# EAGLE design MPU-6050_Breakout V11 (EAGLE 6.4)
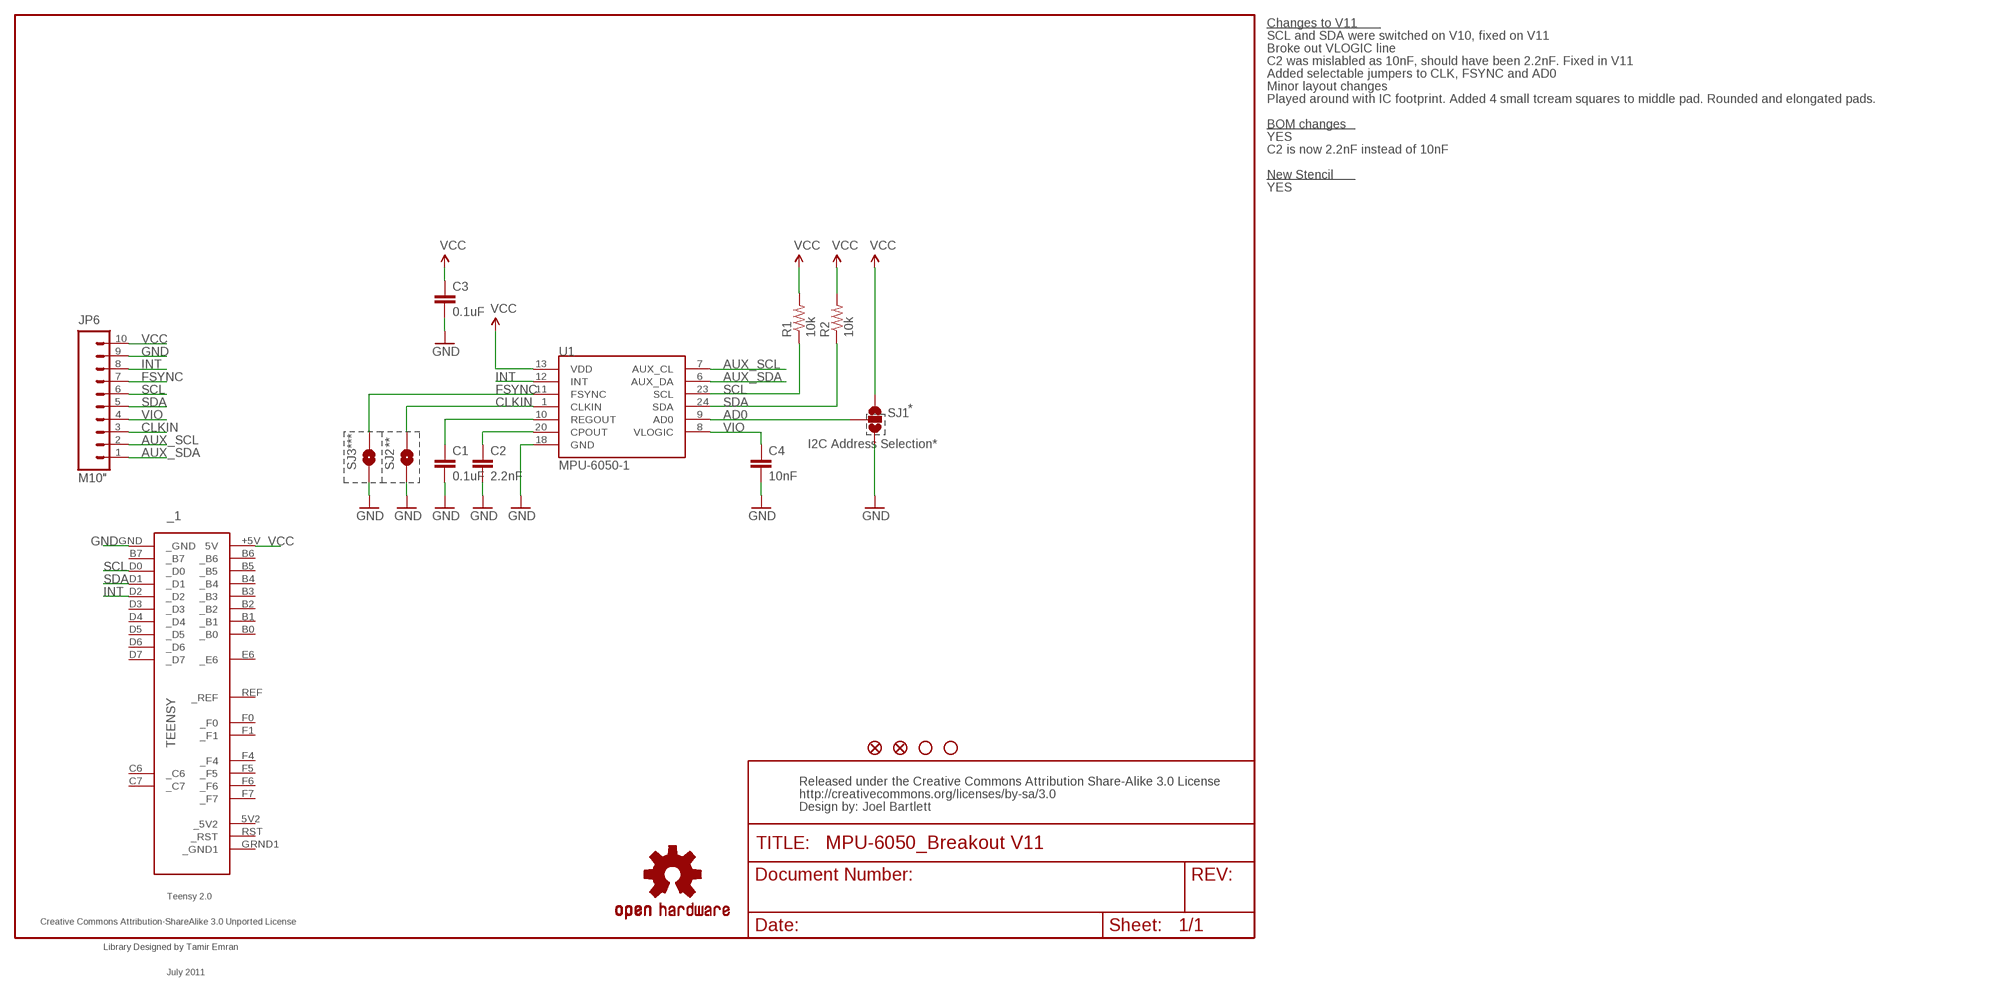
[diagram p0: schematic, sheet 1]

## Parts
_1  TEENSY  [TEENSY]
C1  0.1uF  CAP0402-CAP  [0402-CAP]
C2  2.2nF  CAP0402-CAP  [0402-CAP]
C3  0.1uF  CAP0402-CAP  [0402-CAP]
C4  10nF  CAP0402-CAP  [0402-CAP]
JP2  FIDUCIALUFIDUCIAL  [MICRO-FIDUCIAL]
JP3  STAND-OFFTIGHT  [STAND-OFF-TIGHT]
JP4  STAND-OFFTIGHT  [STAND-OFF-TIGHT]
JP5  FIDUCIALUFIDUCIAL  [MICRO-FIDUCIAL]
JP6  M10"  [1X10]
R1  10k  RESISTOR0402-RES  [0402-RES]
R2  10k  RESISTOR0402-RES  [0402-RES]
SJ1  SOLDERJUMPER_2WAYPASTE2&3  [SJ_3_PASTE2&3]
SJ2  SOLDERJUMPERTRACE  [SJ_2S-TRACE]
SJ3  SOLDERJUMPERTRACE  [SJ_2S-TRACE]
U1  MPU-6050-1  [QFN-24-4MM2]
U3  CREATIVE_COMMONS  [CREATIVE_COMMONS]
U$1  OSHW-LOGOS  [OSHW-LOGO-S]

## Nets
AD0: SJ1.2 U1.9(AD0)
AUX_SCL: JP6.2 U1.7(AUX_CL)
AUX_SDA: JP6.1 U1.6(AUX_DA)
CLKIN: JP6.3 SJ2.2 U1.1(CLKIN)
FSYNC: JP6.7 SJ3.2 U1.11(FSYNC)
GND: _1.GND(_GND) C1.2 C2.2 C3.2 C4.2 JP6.9 SJ1.3 SJ2.1 SJ3.1 U1.18(GND)
INT: _1.D2(_D2) JP6.8 U1.12(INT)
N$3: C2.1 U1.20(CPOUT)
N$5: C1.1 U1.10(REGOUT)
SCL: _1.D0(_D0) JP6.6 R1.1 U1.23(SCL)
SDA: _1.D1(_D1) JP6.5 R2.1 U1.24(SDA)
VCC: _1.+5V(5V) C3.1 JP6.10 R1.2 R2.2 SJ1.1 U1.13(VDD)
VIO: C4.1 JP6.4 U1.8(VLOGIC)
Unconnected: _1.5V2(_5V2) _1.B0(_B0) _1.B1(_B1) _1.B2(_B2) _1.B3(_B3) _1.B4(_B4) _1.B5(_B5) _1.B6(_B6) _1.B7(_B7) _1.C6(_C6) _1.C7(_C7) _1.D3(_D3) _1.D4(_D4) _1.D5(_D5) _1.D6(_D6) _1.D7(_D7) _1.E6(_E6) _1.F0(_F0) _1.F1(_F1) _1.F4(_F4) _1.F5(_F5) _1.F6(_F6) _1.F7(_F7) _1.GRND1(_GND1) _1.REF(_REF) _1.RST(_RST)

## Notes on the sheet
- Changes to V11
- SCL and SDA were switched on V10, fixed on V11
- Broke out VLOGIC line
- C2 was mislabled as 10nF, should have been 2.2nF. Fixed in V11
- Added selectable jumpers to CLK, FSYNC and AD0
- Minor layout changes
- Played around with IC footprint. Added 4 small tcream squares to middle pad. Rounded and elongated pads.
- BOM changes
- YES
- C2 is now 2.2nF instead of 10nF
- New Stencil
- YES
- *
- *** | ** | I2C Address Selection*
- Joel Bartlett

## Library data of the parts
_1 = teensy:TEENSY: Teensy 2.0 Original Design by Clint Fisher Modified Design by Tamir Emran Licensed Under Creative Commons Attribution-ShareAlike 3.0 Unported (CC BY-SA 3.0)
C1-C4 = SparkFun:CAP: Capacitor Standard 0603 ceramic capacitor, and 0.1" leaded capacitor.
JP2 JP5 = SparkFun:FIDUCIAL: Fiducial Alignment Points Various fiducial points for machine vision alignment.
JP3 JP4 = SparkFun:STAND-OFF: Stand Off This is the mechanical footprint for a #4 phillips button head screw. Use the keepout ring to avoid running the screw head into surrounding components. SKU : PRT-00447
JP6 = SparkFun:M10: Header 10 Standard 10-pin 0.1" header. Use with straight break away headers (SKU : PRT-00116), right angle break away headers (PRT-00553), swiss pins (PRT-00743), machine pins (PRT-00117), and female headers (PRT-00115).
R1 R2 = SparkFun:RESISTOR: Resistor Basic schematic elements and footprints for 0603, 1206, and PTH resistors.
SJ1 = SparkFun:SOLDERJUMPER_2WAY: Solder Jumper 2 way solder jumper
SJ2 SJ3 = SparkFun:SOLDERJUMPER: Solder Jumper Standard SMD solder jumper. Used to automate production. Two varients : Normally Open and Normally Closed are the same, but have different paste layers. NC will have a large amount of paste and should jumper during reflow.
U1 = Testing:MPU-6050
U3 = SparkFun:CREATIVE_COMMONS
U$1 = SparkFun:OSHW-LOGO: Open Source Hardware Logo This logo indicates the piece of hardware it is found on incorporates a OSHW license and/or adheres to the definition of open source hardware found here: http://freedomdefined.org/OSHW

## Net classes
0 Default: width 0.203 mm
1 vcc: width 0.254 mm
2 GND: width 0.813 mm

## Board
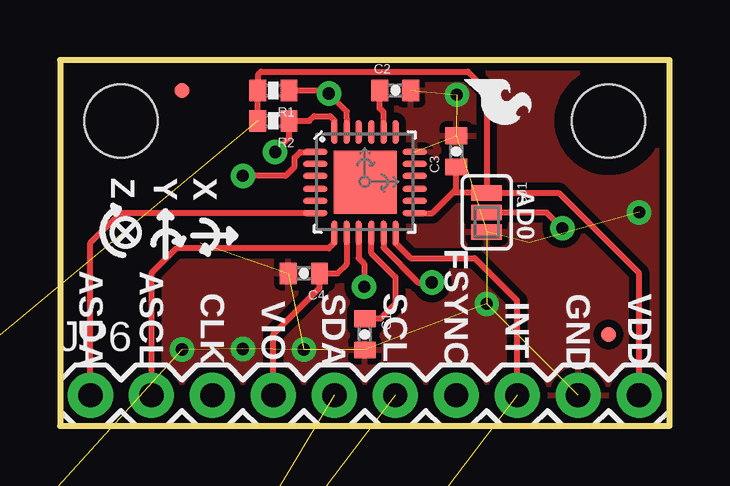
[diagram p1: board, top side]
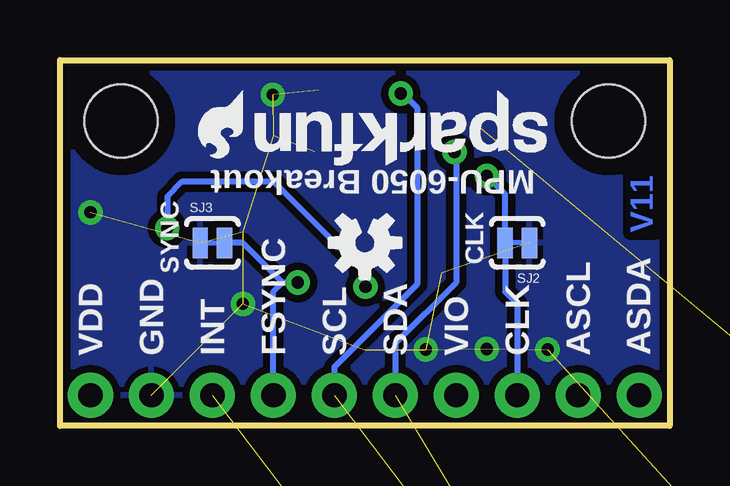
[diagram p2: board, bottom side, seen from below]

Size 25.4 x 15.24 mm. Coordinates in mm from the lower left corner, seen from the top.
Outline: 25.4,0 25.4,15.24 0,15.24 0,0 25.4,0
Copper layers (1*16): Top 0.035mm / dielectric 1.5mm / Bottom 0.035mm
Design rules "default": minimum track width 10mil, minimum drill 20mil, track to track 8mil, track to pad 8mil, pad to pad 8mil, via to via 8mil, smd to smd 8mil, copper to edge 8mil, drill to drill 8mil, minimum pad ring 12mil, minimum via ring 10mil, stop-mask expansion 4mil, vias tented up to drill 20mil, thermal gap 10mil

### Footprints (pad centres in the part's own frame; a part is rotated, then mirrored left to right if it is on the bottom)
TEENSY = drill 1.016 pad 1.88: 5V2 13.97,-2.54; +5V -13.97,7.62; B0 -11.43,-7.62; B1 -8.89,-7.62; B2 -6.35,-7.62; B3 -3.81,-7.62; B4 8.89,7.62; B5 6.35,7.62; B6 3.81,7.62; B7 -1.27,-7.62; C6 11.43,-7.62; C7 13.97,-7.62; D0 1.27,-7.62; D1 3.81,-7.62; D2 6.35,-7.62; D3 8.89,-7.62; D4 13.97,5.08; D5 13.97,-5.08; D6 13.97,7.62; D7 11.43,7.62; E6 -3.81,-5.08; F0 -11.43,7.62; F1 -8.89,7.62; F4 -6.35,7.62; F5 -3.81,7.62; F6 -1.27,7.62; F7 1.27,7.62; GRND1 13.97,0; REF -3.81,5.08; RST 13.97,2.54 | drill 1.016 pad 1.88 square: GND -13.97,-7.62
0402-CAP = smd 0.7 x 0.9: 1 -0.65,0; 2 0.65,0
MICRO-FIDUCIAL = smd 0.635 x 0.635: 1 0,0
STAND-OFF-TIGHT = hole 3.048: 0,0
1X10 = drill 1.016 pad 1.88: 1 0,0; 2 2.54,0; 3 5.08,0; 4 7.62,0; 5 10.16,0; 6 12.7,0; 7 15.24,0; 8 17.78,0; 9 20.32,0; 10 22.86,0
0402-RES = smd 0.7 x 0.9: 1 -0.65,0; 2 0.65,0
SJ_3_PASTE2&3 = smd 0.635 x 1.27: 1 -0.813,0; 2 0,0; 3 0.813,0
SJ_2S-TRACE = smd 0.635 x 1.27: 1 -0.508,0; 2 0.508,0
QFN-24-4MM2 = smd 1.016 x 0.254: 1 -2.066,1.257; 2 -2.066,0.75; 3 -2.066,0.247; 4 -2.066,-0.287; 5 -2.066,-0.792; 6 -2.066,-1.297; 13 2.086,-1.297; 14 2.086,-0.792; 15 2.086,-0.287; 16 2.086,0.247; 17 2.086,0.75; 18 2.086,1.257 | smd 0.254 x 1.016: 7 -1.267,-2.122; 8 -0.762,-2.122; 9 -0.258,-2.122; 10 0.278,-2.122; 11 0.78,-2.122; 12 1.287,-2.122; 19 1.287,2.082; 20 0.78,2.082; 21 0.278,2.082; 22 -0.258,2.082; 23 -0.762,2.082; 24 -1.267,2.082 | smd 2.616 x 2.616: P$1 0.02,-0.01

### Placement (x,y rotation side)
_1  -11.43,-22.86 0 top  (outside the outline)
C1  12.7,3.81 270 top
C2  13.97,13.97 0 top
C3  16.51,11.43 90 top
C4  10.16,6.35 180 top
JP2  5.08,13.97 270 top
JP3  22.86,12.7 270 top
JP4  2.54,12.7 270 top
JP5  22.86,3.81 270 top
JP6  1.27,1.27 0 top
R1  8.89,13.97 180 top
R2  8.89,12.7 180 top
SJ1  17.78,8.89 270 top
SJ2  6.35,7.62 180 bottom
SJ3  19.05,7.62 0 bottom
U1  12.7,10.16 0 top
U3  -8.89,-12.7 0 top  (outside the outline)
U$1  12.7,7.62 180 bottom
U$2  [SFE-LOGO-FLAME]  16.84,14.43 270 top
U$3  [SFE-LOGO-FLAME]  17.78,13.97 180 bottom
U$4  [SFE-NEW-WEB]  5.08,13.97 180 bottom

### Tracks (layer width: path | path; a pad name or v marks a point on that pad's centre or on a via)
AD0  (via drill 0.51)
  Top 0.254: 12.45,8.16 U1.9 12.44,6.99 12.68,6.76 v12.68,5.79 | v20.93,8.23 20.27,8.89 SJ1.2
  Bottom 0.254: v20.93,8.23 20.93,9.55 20.32,10.16 16.48,10.16 12.68,6.35 v12.68,5.79
AUX_SCL
  Top 0.254: 11.43,8.14 U1.7 11.43,7.62 11.2,7.39 4.85,7.39 3.81,6.35 JP6.2
AUX_SDA
  Top 0.254: JP6.1 1.27,7.62 2.51,8.86 U1.6
CLKIN  (via drill 0.51)
  Top 0.254: v7.62,10.41 9.4,10.41 9.78,10.79 9.78,11.18 10.01,11.4 10.62,11.4 U1.1
  Bottom 0.254: v7.62,10.41 6.86,9.65 SJ2.2 6.86,5.59 6.35,5.08 JP6.3
FSYNC  (via drill 0.51)
  Top 0.254: U1.11 13.48,7.42 14.94,5.97 v15.49,5.97
  Bottom 0.254: JP6.7 16.51,5.59 16.13,5.97 | v15.49,5.97 16.13,5.97 | 16.13,5.97 17.78,7.62 SJ3.2
GND  (via drill 0.51)  (15 unrouted)
  other vias: 16.54,13.79 17.78,5.08 24.13,8.89 10.16,3.17 7.62,3.2 5.08,3.17
  pour Top (isolate 0.305): 25.4,15.24 0,15.24 0,0 25.4,0
  pour Bottom (isolate 0.305): 25.4,15.24 0,15.24 0,0 25.4,0
INT  (1 unrouted)
  Top 0.254: JP6.8 19.05,5.21 17.27,6.99 14.61,6.99 13.99,7.6 U1.12
N$3
  Top 0.254: C2.1 13.32,13.22 13.48,13.06 U1.20
N$5
  Top 0.254: 12.95,8.16 U1.10 12.98,7.19 13.97,6.2 13.97,5.08 13.35,4.46 C1.1
SCL  (via drill 0.51)  (1 unrouted)
  Top 0.254: U1.23 11.95,12.79 11.95,13.09 v11.2,13.84 11.07,13.97 R1.1
  Bottom 0.254: JP6.6 13.97,2.44 10.52,5.89 10.52,13.26 11.1,13.84 v11.2,13.84
SDA  (via drill 0.51)  (1 unrouted)
  Top 0.254: v8.97,11.4 9.54,11.98 R2.1 10.39,12.7 10.59,12.9 11.25,12.9 11.43,12.72 U1.24
  Bottom 0.254: v8.97,11.4 8.89,11.33 8.89,5.97 11.43,3.43 JP6.5
VCC  (1 unrouted)
  Top 0.254: R2.2 R1.2 8.24,14.62 8.38,14.76 16.99,14.76 17.78,13.97 SJ1.1 | SJ1.1 20.78,9.7 24.13,6.35 JP6.10 | SJ1.1 16.36,9.7 | U1.13 15.52,8.86 16.36,9.7 | 16.36,9.7 16.51,9.86 C3.1
VIO
  Top 0.254: U1.8 11.94,6.73 11.56,6.35 C4.1 10.81,5.73 8.89,3.81 JP6.4

### Text on the board
Bottom: V11
tPlace: Z | Y | X | AD0 | FSYNC | ASDA | ASCL | CLK | SDA | SCL | GND | VDD | VIO | INT
bPlace: MPU-6050 Breakout | CLK | SYNC | ASDA | ASCL | CLK | VIO | SDA | SCL | FSYNC | INT | GND | VDD
tValues: Joel Bartlett